# Altium schematic sheet PLD_LMT87_HK_MUX.SchDoc: RadFET
size A4
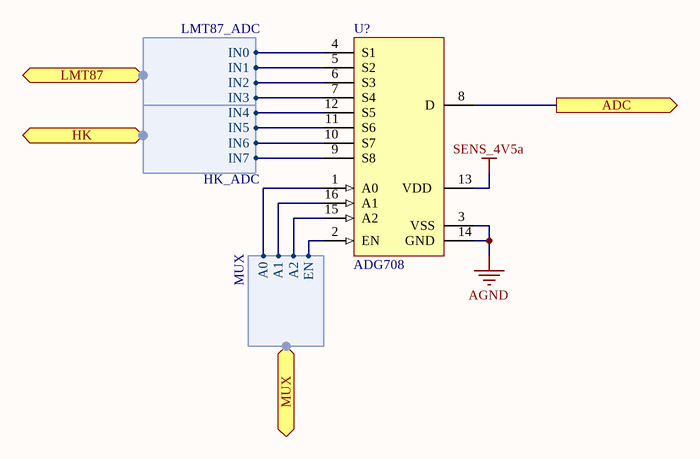
[diagram p0: PLD_LMT87_HK_MUX.SchDoc]

## Parts
U?  ADG708  [TSSOP16]

## Ports
ADC (out), HK (harness HK_ADC), LMT87 (harness LMT87_ADC), MUX (harness MUX)

## Harnesses
LMT87_ADC: IN0, IN1, IN2, IN3
HK_ADC: IN5, IN6, IN7, IN4
MUX: A0, A1, A2, EN

## Nets
AGND: U?.3(VSS) U?.14(GND)
SENS_4V5a: U?.13(VDD)
ADC: U?.8(D) ; port ADC
NetU?_1: U?.1(A0) ; port MUX.A0
NetU?_2: U?.2(EN) ; port MUX.EN
NetU?_4: U?.4(S1) ; port LMT87.IN0
NetU?_5: U?.5(S2) ; port LMT87.IN1
NetU?_6: U?.6(S3) ; port LMT87.IN2
NetU?_7: U?.7(S4) ; port LMT87.IN3
NetU?_9: U?.9(S8) ; port HK.IN7
NetU?_10: U?.10(S7) ; port HK.IN6
NetU?_11: U?.11(S6) ; port HK.IN5
NetU?_12: U?.12(S5) ; port HK.IN4
NetU?_15: U?.15(A2) ; port MUX.A2
NetU?_16: U?.16(A1) ; port MUX.A1

## Notes on the sheet
- Title:
- Project:
- Author:
- Model:
- Document Number:
- Checked by:
- Rev:
- Date:
- Approved by:
- Sheet:
- of
- File name:

## Library data of the parts
U? = ADG708: CMOS Analog 8:1 Multiplexer; Manufacturer: Analog Devices; ManufacturerPartNumber: ADG708